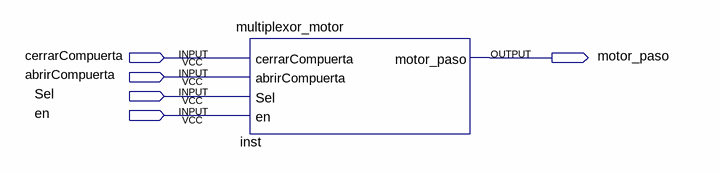
[diagram p0: schematic sheet]
// Quartus schematic bloqueMultiplexorMotor.bdf as structural Verilog: 1 symbols, 5 pins
module bloqueMultiplexorMotor (
  input  cerrarCompuerta,
  input  abrirCompuerta,
  input  Sel,
  input  en,
  output motor_paso
);

  multiplexor_motor inst (
    .cerrarCompuerta(cerrarCompuerta), .abrirCompuerta(abrirCompuerta), .Sel(Sel), .en(en),
    .motor_paso(motor_paso));
endmodule
